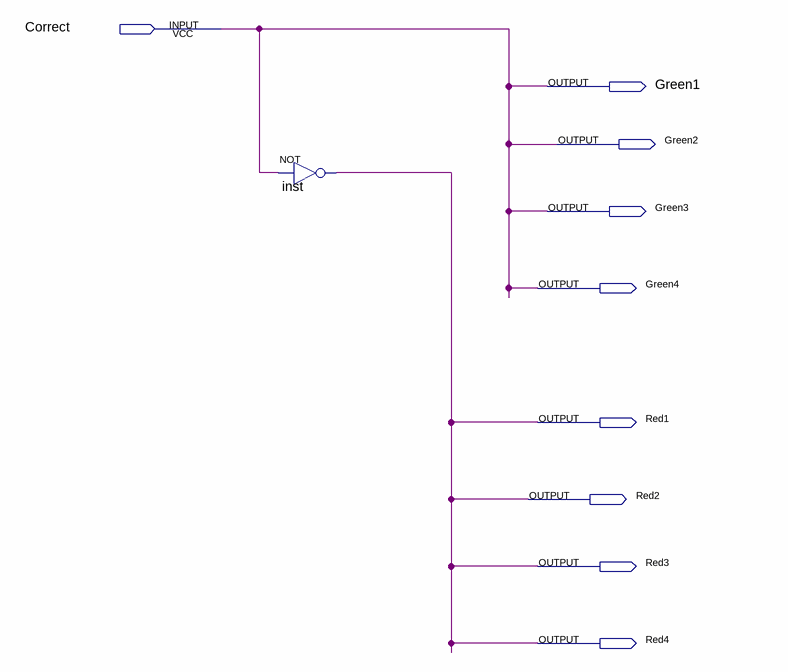
[diagram p0: schematic sheet]
// Quartus schematic LED.bdf as structural Verilog: 1 symbols, 9 pins
module LED (
  input  Correct,
  output Green1,
  output Green2,
  output Green3,
  output Green4,
  output Red1,
  output Red2,
  output Red3,
  output Red4
);

  not inst (Red1, Correct);

  assign Green1 = Correct;
  assign Green2 = Correct;
  assign Green3 = Correct;
  assign Green4 = Correct;
  assign Red2 = Red1;
  assign Red3 = Red1;
  assign Red4 = Red1;
endmodule
